# EAGLE design Chessbot_v7 (EAGLE 9.6.2)
AUTHOR: Hudson, Dunn, Ruiz; BOARD_NAME: ChessBotBoard; DOC_NUM: 1; PROJECT_NAME: Chess Bot; REVISION: 7
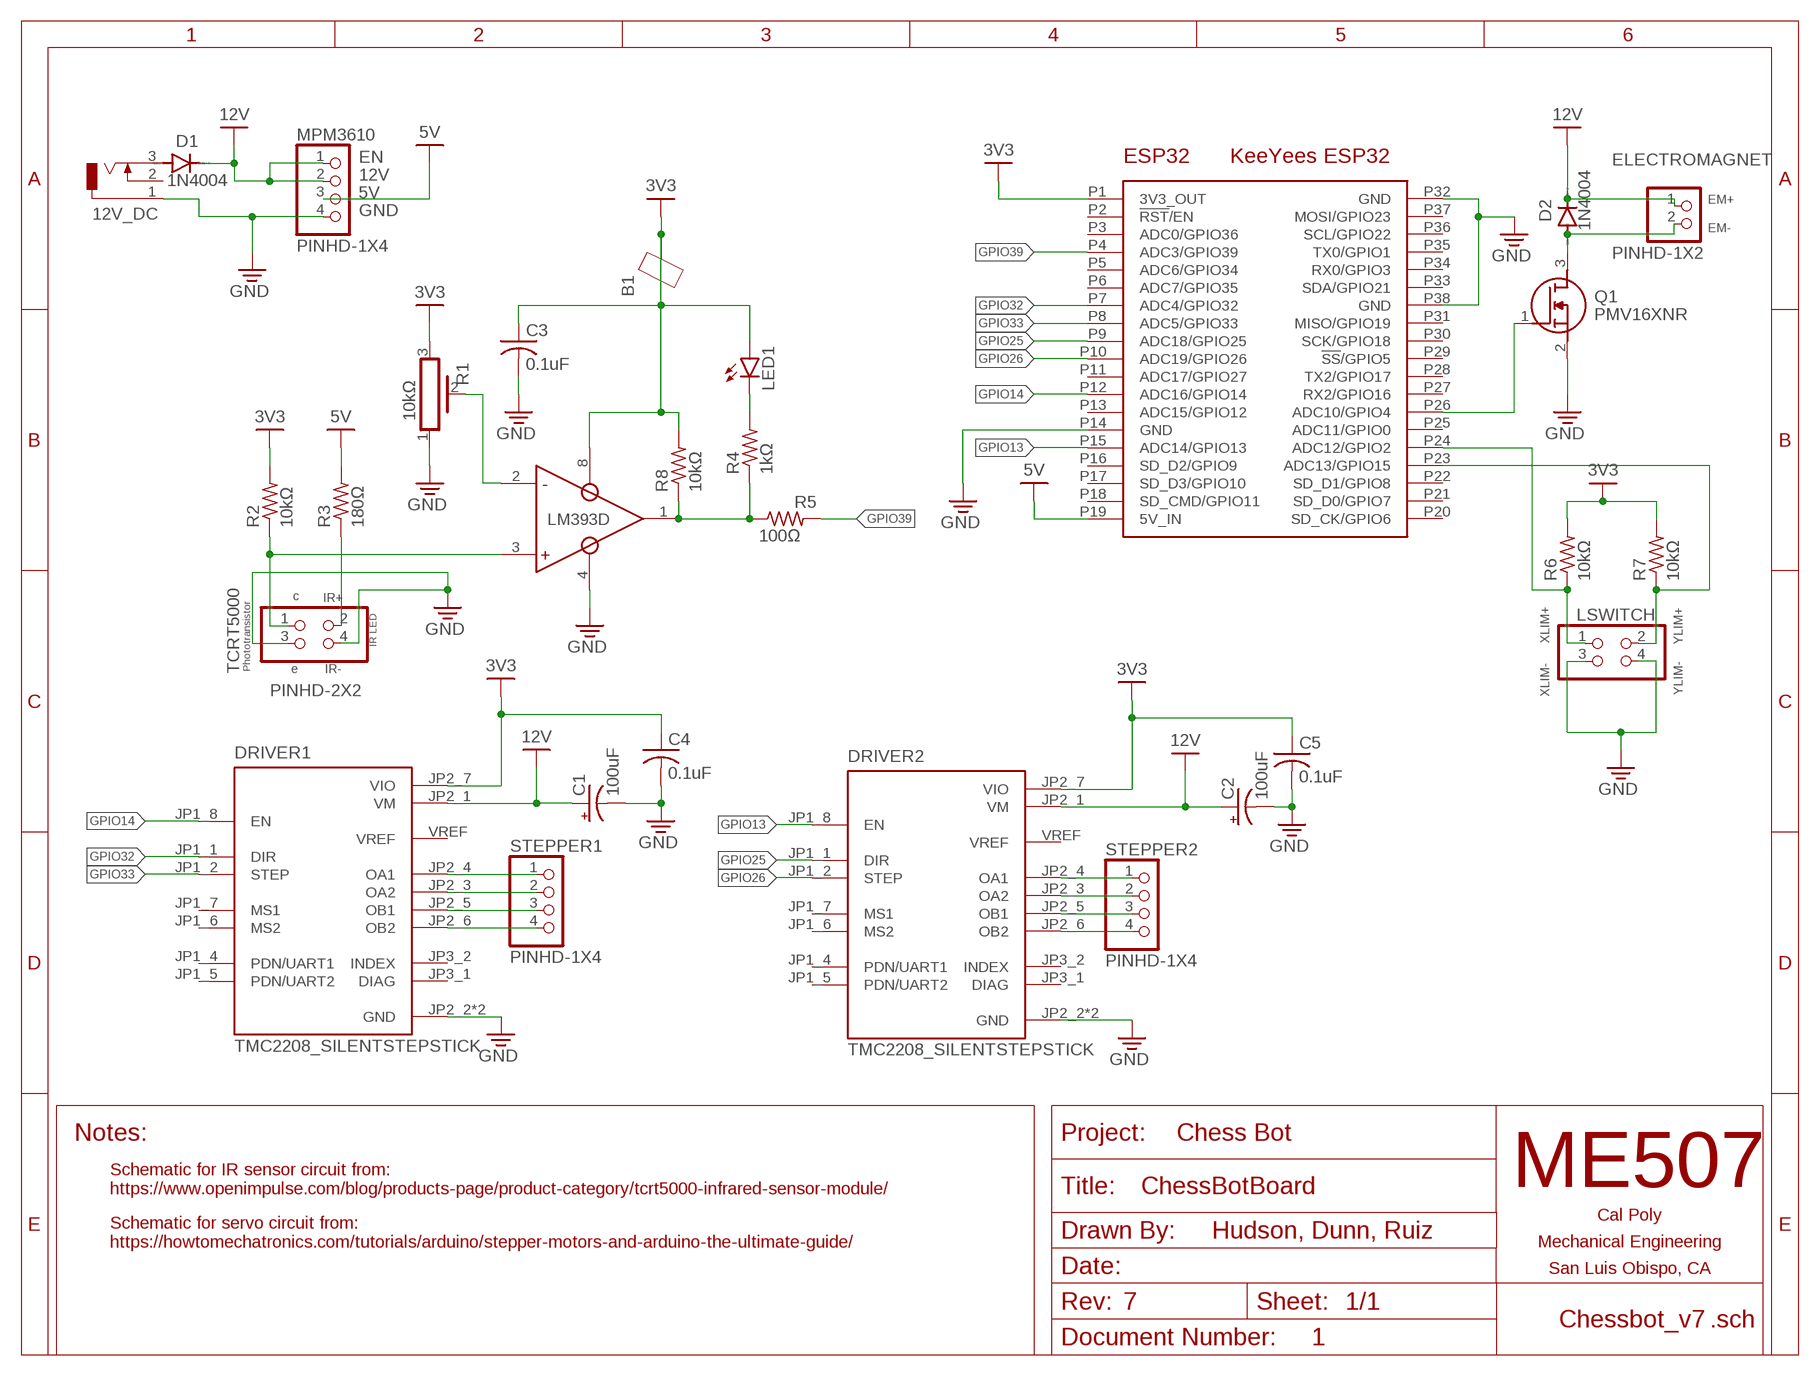
[diagram p0: schematic, sheet 1]

## Parts
12V_DC  DCJ0303  [DCJ0303]
B1  BEAD0805  [0805]
C1  100uF  CPOL-USE2.5-6  [E2,5-6]
C2  100uF  CPOL-USE2.5-6  [E2,5-6]
C3  0.1uF  C-USC0805  [C0805]
C4  0.1uF  C-USC0805  [C0805]
C5  0.1uF  C-USC0805  [C0805]
D1  1N4004  [DO41-10]
D2  1N4004  [DO41-10]
DRIVER1  TMC2208_SILENTSTEPSTICK  [MODULE_TMC2208_SILENTSTEPSTICK]
DRIVER2  TMC2208_SILENTSTEPSTICK  [MODULE_TMC2208_SILENTSTEPSTICK]
ELECTROMAGNET  PINHD-1X2  [1X02]
ESP32  KEEYEES_ESP32  [KEEYEES_ESP32]
LED1  LEDSMT1206  [1206]
LSWITCH  PINHD-2X2  [2X02]
MPM3610  PINHD-1X4  [1X04]
Q1  PMV16XNR  [SOT95P230X110-3N]
R1  10kΩ  PV36Z  [PV36Z]
R2  10kΩ  R-US_R0805  [R0805]
R3  180Ω  R-US_R0805  [R0805]
R4  1kΩ  R-US_R0805  [R0805]
R5  100Ω  R-US_R0805  [R0805]
R6  10kΩ  R-US_R0805  [R0805]
R7  10kΩ  R-US_R0805  [R0805]
R8  10kΩ  R-US_R0805  [R0805]
STEPPER1  PINHD-1X4  [1X04]
STEPPER2  PINHD-1X4  [1X04]
TCRT5000  PINHD-2X2  [2X02]
U$2  LM393D  [LM393D]

## Nets
3V3: B1.1 B1.2 C3.1 C4.1 C5.1 DRIVER1.JP2_7(VIO) DRIVER2.JP2_7(VIO) ESP32.P1(3V3_OUT) LED1.A R1.3 R2.2 R6.2 R7.2 R8.2 U$2.8(VCC)
5V: ESP32.P19(5V_IN) MPM3610.3 R3.2
12V: C1.+ C2.+ D1.C D2.C DRIVER1.JP2_1(VM) DRIVER2.JP2_1(VM) ELECTROMAGNET.1 MPM3610.1 MPM3610.2
GND: 12V_DC.1 C1.- C2.- C3.2 C4.2 C5.2 DRIVER1.JP2_2(GND) DRIVER1.JP2_8(GND) DRIVER2.JP2_2(GND) DRIVER2.JP2_8(GND) ESP32.P14(GND) ESP32.P32(GND) ESP32.P38(GND) LSWITCH.3 LSWITCH.4 MPM3610.4 Q1.2(S) R1.1 TCRT5000.3 TCRT5000.4 U$2.4(GND)
GPIO13: DRIVER2.JP1_8(EN) ESP32.P15(ADC14/GPIO13)
GPIO14: DRIVER1.JP1_8(EN) ESP32.P12(ADC16/GPIO14)
GPIO25: DRIVER2.JP1_1(DIR) ESP32.P9(ADC18/GPIO25)
GPIO26: DRIVER2.JP1_2(STEP) ESP32.P10(ADC19/GPIO26)
GPIO32: DRIVER1.JP1_1(DIR) ESP32.P7(ADC4/GPIO32)
GPIO33: DRIVER1.JP1_2(STEP) ESP32.P8(ADC5/GPIO33)
GPIO39: ESP32.P4(ADC3/GPIO39) R5.2
N$1: R1.2 U$2.2(IN-)
N$2: DRIVER1.JP2_4(OA1) STEPPER1.1
N$3: DRIVER1.JP2_3(OA2) STEPPER1.2
N$4: R3.1 TCRT5000.2
N$5: DRIVER1.JP2_5(OB1) STEPPER1.3
N$6: R2.1 TCRT5000.1 U$2.3(IN+)
N$7: DRIVER1.JP2_6(OB2) STEPPER1.4
N$8: DRIVER2.JP2_4(OA1) STEPPER2.1
N$9: D2.A ELECTROMAGNET.2 Q1.3(D)
N$10: DRIVER2.JP2_3(OA2) STEPPER2.2
N$11: DRIVER2.JP2_5(OB1) STEPPER2.3
N$12: DRIVER2.JP2_6(OB2) STEPPER2.4
N$14: LED1.C R4.2
N$15: 12V_DC.3 D1.A
N$16: R4.1 R5.1 R8.1 U$2.1(OUT)
N$17: ESP32.P26(ADC10/GPIO4) Q1.1(G)
N$18: ESP32.P24(ADC12/GPIO2) LSWITCH.1 R6.1
N$22: ESP32.P23(ADC13/GPIO15) LSWITCH.2 R7.1
Unconnected: 12V_DC.2 DRIVER1.JP1_4(PDN/UART1) DRIVER1.JP1_5(PDN/UART2) DRIVER1.JP1_6(MS2) DRIVER1.JP1_7(MS1) DRIVER1.JP3_1(DIAG) DRIVER1.JP3_2(INDEX) DRIVER1.VREF DRIVER2.JP1_4(PDN/UART1) DRIVER2.JP1_5(PDN/UART2) DRIVER2.JP1_6(MS2) DRIVER2.JP1_7(MS1) DRIVER2.JP3_1(DIAG) DRIVER2.JP3_2(INDEX) DRIVER2.VREF ESP32.P2(!RST!/EN) ESP32.P3(ADC0/GPIO36) ESP32.P5(ADC6/GPIO34) ESP32.P6(ADC7/GPIO35) ESP32.P11(ADC17/GPIO27) ESP32.P13(ADC15/GPIO12) ESP32.P16(SD_D2/GPIO9) ESP32.P17(SD_D3/GPIO10) ESP32.P18(SD_CMD/GPIO11) ESP32.P20(SD_CK/GPIO6) ESP32.P21(SD_D0/GPIO7) ESP32.P22(SD_D1/GPIO8) ESP32.P25(ADC11/GPIO0) ESP32.P27(RX2/GPIO16) ESP32.P28(TX2/GPIO17) ESP32.P29(!SS!/GPIO5) ESP32.P30(SCK/GPIO18) ESP32.P31(MISO/GPIO19) ESP32.P33(SDA/GPIO21) ESP32.P34(RX0/GPIO3) ESP32.P35(TX0/GPIO1) ESP32.P36(SCL/GPIO22) ESP32.P37(MOSI/GPIO23) U$2.5(IN+) U$2.6(IN-) U$2.7(OUT)

## Notes on the sheet
- EN
- 12V
- 5V
- EM+
- GND
- EM-
- c | IR+
- YLIM+
- XLIM+
- IR LED
- Phototransistor | e | IR-
- XLIM- | YLIM-
- Schematic for IR sensor circuit from:
  https://www.openimpulse.com/blog/products-page/product-category/tcrt5000-infrared-sensor-module/
- Schematic for servo circuit from:
  https://howtomechatronics.com/tutorials/arduino/stepper-motors-and-arduino-the-ultimate-guide/

## Library data of the parts
12V_DC = con-jack:DCJ0303: DC POWER JACK Source: DCJ0303.pdf; OC_FARNELL: unknown; OC_NEWARK: unknown
B1 = ME507:BEAD: Ferrite Bead
C1 C2 = rcl:CPOL-US: POLARIZED CAPACITOR, American symbol; SPICEPREFIX: C
C3-C5 = rcl:C-US: CAPACITOR, American symbol; SPICEPREFIX: C
D1 D2 = diode:1N4004: DIODE general purpose rectifier, 1 A
DRIVER1 DRIVER2 = TMC2208_SILENTSTEPSTICK:TMC2208_SILENTSTEPSTICK: TMC2208 Motor Controller/Driver, Stepper Power Management Evaluation Board Check availability <https://pricing.snapeda.com/parts/TMC2208%20SILENTSTEPSTICK/Trinamic%20Motion/view-part?ref=eda>; AVAILABILITY: In Stock; DESCRIPTION: TMC2208 Motor Controller/Driver, Stepper Power Management Evaluation Board; MF: Trinamic Motion; MP: TMC2208 SILENTSTEPSTICK; PACKAGE: None; PRICE: None; PURCHASE-URL: https://pricing.snapeda.com/search/part/TMC2208 SILENTSTEPSTICK/?ref=eda
ELECTROMAGNET = Connector:PINHD-1X2: PIN HEADER; CATEGORY: CONNECTOR; SUB-CATEGORY: PIN-HEADER
ESP32 = ME507:KEEYEES_ESP32: Footprint for an add-on board (shield, hat, etc.) for a KeeYees ESP32 development board with ESP-WROOM-32 module. 38 pins.
LED1 = led:LED: LED OSRAM: - CHIPLED LG R971, LG N971, LY N971, LG Q971, LY Q971, LO R971, LY R971 LH N974, LH R974 LS Q976, LO Q976, LY Q976 LO Q996 - Hyper CHIPLED LW Q18S LB Q993, LB Q99A, LB R99A - SideLED LS A670, LO A670, LY A670, LG A670, LP A670 LB A673, LV A673, LT A673, LW A673 LH A674 LY A675 LS A676, LA A676, LO A676, LY A676, LW A676 LS A679, LY A679, LG A679 - Hyper Micro SIDELED® LS Y876, LA Y876, LO Y876, LY Y876 LT Y87S - SmartLED LW L88C, LW L88S LB L89C, LB L89S, LG L890 LS L89K, LO L89K, LY L89K LS L896, LA L896, LO L896, LY L896 - TOPLED LS T670, LO T670, LY T670, LG T670, LP T670 LSG T670, LSP T670, LSY T670, LOP T670, LYG T670 LG T671, LOG T671, LSG T671 LB T673, LV T673, LT T673, LW T673 LH T674 LS T676, LA T676, LO T676, LY T676, LB T676, LH T676, LSB T676, LW T676 LB T67C, LV T67C, LT T67C, LS T67K, LO T67K, LY T67K, LW E67C LS E67B, LA E67B, LO E67B, LY E67B, LB E67C, LV E67C, LT E67C LW T67C LS T679, LY T679, LG T679 LS T770, LO T770, LY T770, LG T770, LP T770 LB T773, LV T773, LT T773, LW T773 LH T774 LS E675, LA E675, LY E675, LS T675 LS T776, LA T776, LO T776, LY T776, LB T776 LHGB T686 LT T68C, LB T68C - Hyper Mini TOPLED® LB M676 - Mini TOPLED Santana® LG M470 LS M47K, LO M47K, LY M47K Source: http://www.osram.convergy.de LUXEON: - LUMILED® LXK2-PW12-R00, LXK2-PW12-S00, LXK2-PW14-U00, LXK2-PW14-V00 LXK2-PM12-R00, LXK2-PM12-S00, LXK2-PM14-U00 LXK2-PE12-Q00, LXK2-PE12-R00, LXK2-PE12-S00, LXK2-PE14-T00, LXK2-PE14-U00 LXK2-PB12-K00, LXK2-PB12-L00, LXK2-PB12-M00, LXK2-PB14-N00, LXK2-PB14-P00, LXK2-PB14-Q00 LXK2-PR12-L00, LXK2-PR12-M00, LXK2-PR14-Q00, LXK2-PR14-R00 LXK2-PD12-Q00, LXK2-PD12-R00, LXK2-PD12-S00 LXK2-PH12-R00, LXK2-PH12-S00 LXK2-PL12-P00, LXK2-PL12-Q00, LXK2-PL12-R00 Source: www.luxeon.com KINGBRIGHT: KA-3528ASYC Source: www.kingbright.com
LSWITCH = pinhead:PINHD-2X2: PIN HEADER
MPM3610 STEPPER1 STEPPER2 = Connector:PINHD-1X4: PIN HEADER; CATEGORY: CONNECTOR; SUB-CATEGORY: PIN-HEADER
Q1 = PMV16XNR:PMV16XNR: Nexperia PMV16XNR N-channel MOSFET, 8.6 A, 20 V PMV16XN, 3-Pin SOT-23 Source: Datasheet <https://assets.nexperia.com/documents/data-sheet/PMV16XN.pdf>; DESCRIPTION: Nexperia PMV16XNR N-channel MOSFET, 8.6 A, 20 V PMV16XN, 3-Pin SOT-23; HEIGHT: 1.1mm; MANUFACTURER_NAME: Nexperia; MANUFACTURER_PART_NUMBER: PMV16XNR; MOUSER_PART_NUMBER: 771-PMV16XNR; MOUSER_PRICE-STOCK: https://www.mouser.co.uk/ProductDetail/Nexperia/PMV16XNR?qs=%252BRKXB2WKlSfp5fVW5DDV6w%3D%3D
R1 = Resistor:PV36: Rectangular Trimmer Potentiometers - PV36 Series Datasheet <https://www.bourns.com/docs/Product-Datasheets/pv36.pdf>; CATEGORY: Resistor; DESCRIPTION: Lead Sealed Type Multiturn PV36 Series; MANUFACTURER: BOURNS; MPN: PV36Z; OPERATING_TEMPERATURE: -55 to +125 °C; PART_STATUS: Active; ROHS_COMPLIANCE: RoHS Compliant; SERIES: PV36; SUB-CATEGORY: Trimpot; TYPE: Lead Sealed
R2-R8 = rcl:R-US_: RESISTOR, American symbol; SPICEPREFIX: R
TCRT5000 = Connector:PINHD-2X2: PIN HEADER; CATEGORY: CONNECTOR; SUB-CATEGORY: PIN-HEADER
U$2 = lm393d:LM393D

## Board
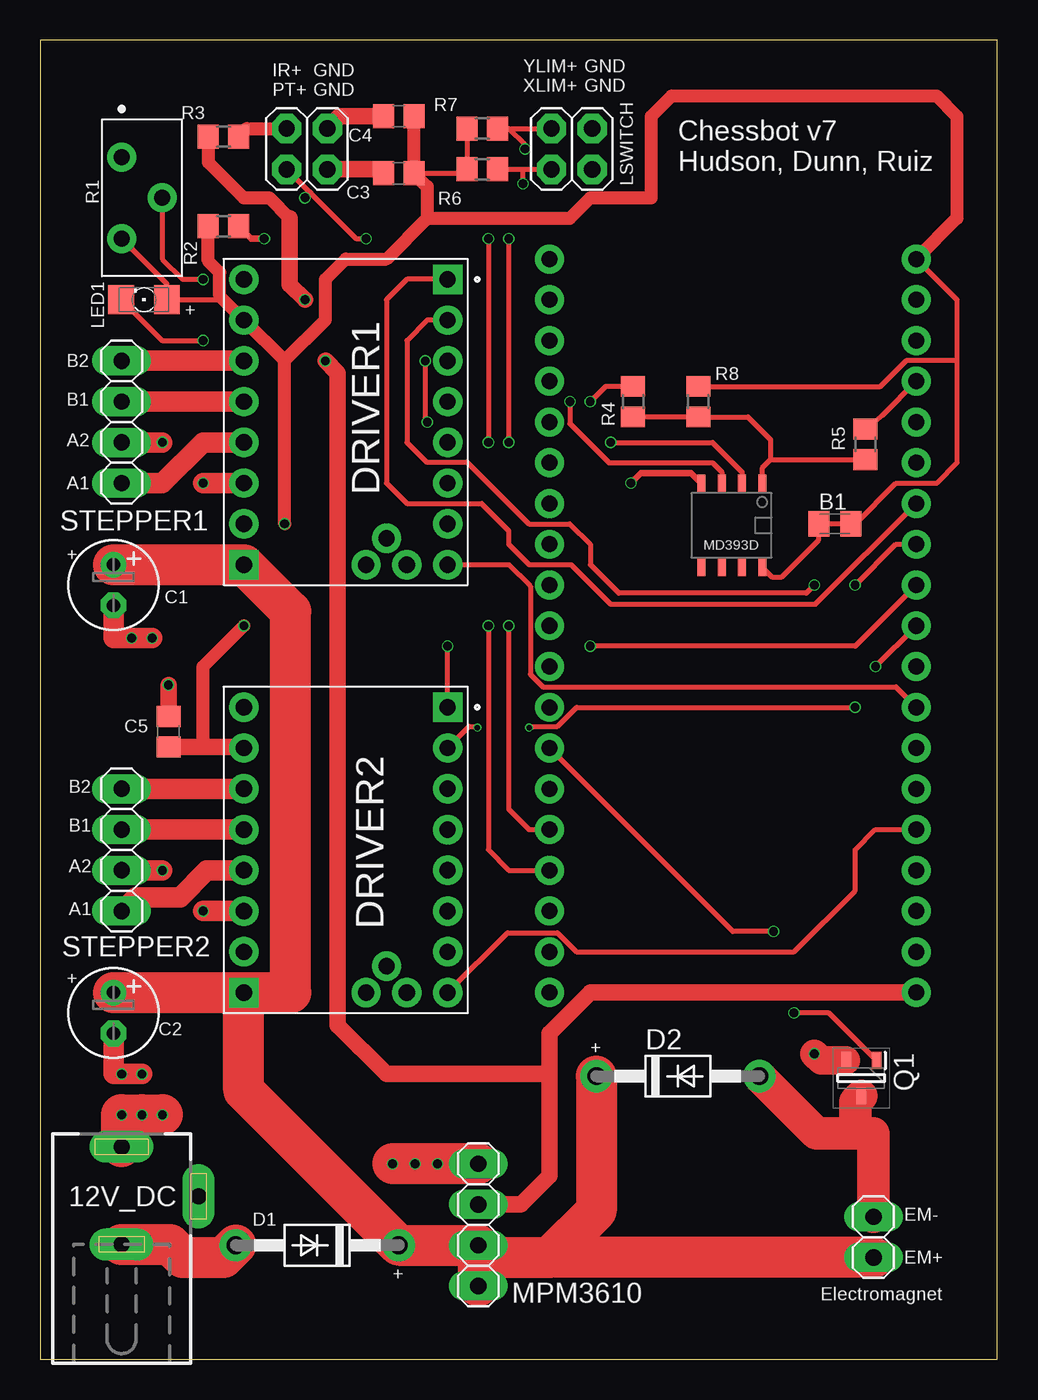
[diagram p1: board, top side]
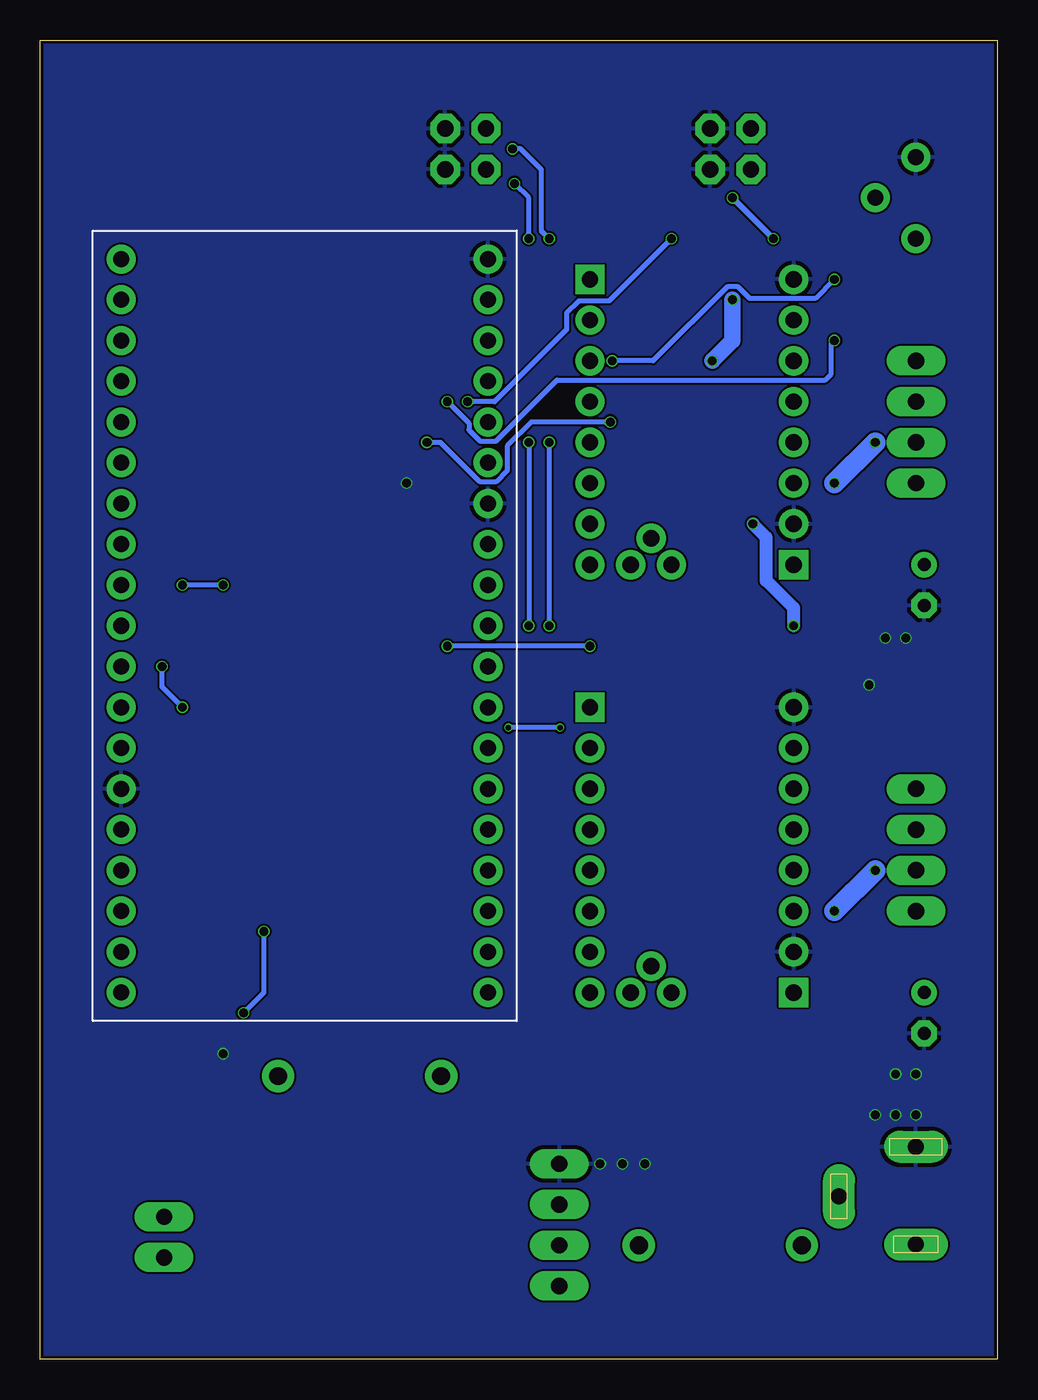
[diagram p2: board, bottom side, seen from below]

Size 59.67 x 82.22 mm. Coordinates in mm from the lower left corner, seen from the top.
Outline: 0,0 59.67,0 59.67,82.22 0,82.22 0,0
Copper layers (1*16): Top 0.035mm / dielectric 1.6mm / Bottom 0.035mm
Design rules "jlcpcb-2layers": minimum track width 5mil, minimum drill 0.3mm, track to track 5mil, track to pad 5mil, pad to pad 5mil, via to via 5mil, smd to smd 5mil, copper to edge 0.2mm, drill to drill 6mil, minimum pad ring 10mil, minimum via ring 3mil, stop-mask expansion 4mil, vias tented up to drill 0mil, thermal gap 10mil

### Footprints (pad centres in the part's own frame; a part is rotated, then mirrored left to right if it is on the bottom)
DCJ0303 = drill 1 pad 2 long: 1 0,3.1; 2 4.8,0; 3 0,-3
0805 = smd 1.3 x 1.6: 1 -1,0; 2 1,0
E2,5-6 = drill 0.813 pad 1.6: + -1.27,0 | drill 0.813 pad 1.6 octagon: - 1.27,0
C0805 = smd 1.3 x 1.5: 1 -0.95,0; 2 0.95,0
DO41-10 = drill 1.118: A 5.08,0; C -5.08,0
MODULE_TMC2208_SILENTSTEPSTICK = drill 1.016 square: JP1_1 6.35,8.89; JP2_1 -6.35,-8.89 | drill 1.016: JP1_2 6.35,6.35; JP1_3 6.35,3.81; JP1_4 6.35,1.27; JP1_5 6.35,-1.27; JP1_6 6.35,-3.81; JP1_7 6.35,-6.35; JP1_8 6.35,-8.89; JP2_2 -6.35,-6.35; JP2_3 -6.35,-3.81; JP2_4 -6.35,-1.27; JP2_5 -6.35,1.27; JP2_6 -6.35,3.81; JP2_7 -6.35,6.35; JP2_8 -6.35,8.89; JP3_1 1.27,-8.89; JP3_2 3.81,-8.89; VREF 2.54,-7.239
1X02 = drill 1.016 long: 1 -1.27,0; 2 1.27,0
KEEYEES_ESP32 = drill 1 pad 1.778: P1 -11.43,21.59; P2 -11.43,19.05; P3 -11.43,16.51; P4 -11.43,13.97; P5 -11.43,11.43; P6 -11.43,8.89; P7 -11.43,6.35; P8 -11.43,3.81; P9 -11.43,1.27; P10 -11.43,-1.27; P11 -11.43,-3.81; P12 -11.43,-6.35; P13 -11.43,-8.89; P14 -11.43,-11.43; P15 -11.43,-13.97; P16 -11.43,-16.51; P17 -11.43,-19.05; P18 -11.43,-21.59; P19 -11.43,-24.13; P20 11.43,-24.13; P21 11.43,-21.59; P22 11.43,-19.05; P23 11.43,-16.51; P24 11.43,-13.97; P25 11.43,-11.43; P26 11.43,-8.89; P27 11.43,-6.35; P28 11.43,-3.81; P29 11.43,-1.27; P30 11.43,1.27; P31 11.43,3.81; P32 11.43,6.35; P33 11.43,8.89; P34 11.43,11.43; P35 11.43,13.97; P36 11.43,16.51; P37 11.43,19.05; P38 11.43,21.59
1206 = smd 1.6 x 1.803: A -1.422,0; C 1.422,0
2X02 = drill 1.016 octagon: 1 -1.27,-1.27; 2 -1.27,1.27; 3 1.27,-1.27; 4 1.27,1.27
1X04 = drill 1.016 long: 1 -3.81,0; 2 -1.27,0; 3 1.27,0; 4 3.81,0
SOT95P230X110-3N = smd 1.05 x 0.6: 1 -1.1,0.95; 2 -1.1,-0.95; 3 1.1,0
PV36Z = drill 1 pad 1.564: 1 0,0; 2 2.54,2.54; 3 5.08,0
R0805 = smd 1.3 x 1.5: 1 -0.95,0; 2 0.95,0
LM393D = smd 0.5 x 1.1: 1 0.57,-0.62; 2 1.84,-0.62; 3 3.11,-0.62; 4 4.38,-0.62; 5 4.38,4.62; 6 3.11,4.62; 7 1.84,4.62; 8 0.57,4.62

### Placement (x,y rotation side)
12V_DC  5.08,10.16 0 top
B1  49.53,52.07 0 top
C1  4.57,48.26 270 top
C2  4.57,21.59 270 top
C3  22.35,73.91 180 top
C4  22.35,77.47 180 top
C5  8,39.12 90 top
D1  17.27,7.11 180 top
D2  39.75,17.65 0 top
DRIVER1  19.05,58.42 0 top
DRIVER2  19.05,31.75 0 top
ELECTROMAGNET  51.94,7.62 90 top
ESP32  43.18,46.99 0 bottom
LED1  6.48,66.04 180 top
LSWITCH  33.15,75.44 0 top
MPM3610  27.3,8.38 90 top
Q1  51.18,17.53 270 top
R1  5.08,74.93 270 top
R2  11.43,70.61 180 top
R3  11.43,76.2 180 top
R4  36.96,59.69 90 top
R5  51.44,57.02 90 top
R6  27.56,74.17 180 top
R7  27.56,76.71 180 top
R8  41.02,59.69 90 top
STEPPER1  5.08,58.42 90 top
STEPPER2  5.08,31.75 90 top
TCRT5000  16.64,75.44 0 top
U$2  45.59,53.98 180 top

### Tracks (layer width: path | path; a pad name or v marks a point on that pad's centre or on a via)
3V3  (via drill 0.55)
  Top 0.305: ESP32.P1 57.15,66.04 57.15,62.23 | 57.15,62.23 57.15,55.88 55.88,54.61 53.34,54.61 50.8,52.07 B1.2 B1.1 48.53,51.07 46.23,48.77 45.61,48.77 U$2.8 | 57.15,62.23 53.98,62.23 52.38,60.64 R8.2 | R1.3 7.9,67.03 LED1.A 10.96,66.04 11.2,66.27 | R7.2 R6.2 | C3.1 26.36,73.91
  Top 0.813: 10.16,38.17 10.16,43.18 v12.7,45.72 | v15.24,52.07 15.24,62.23 | 15.24,62.23 DRIVER1.JP2_7 11.2,66.27 11.2,67.74 10.48,68.46 R2.2 | 15.24,62.23 17.78,64.77 17.78,67.31 19.05,68.58 21.59,68.58 24.13,71.12 | 26.36,73.91 R6.2 | 24.13,71.12 33.02,71.12 34.29,72.39 38.1,72.39 38.1,77.47 39.37,78.74 55.88,78.74 57.15,77.47 57.15,71.12 ESP32.P1 | 24.13,71.12 24.13,73.09 C3.1 C4.1
  Top 1.016: C5.1 10.16,38.17 12.63,38.17 DRIVER2.JP2_7
  Bottom 0.813: v12.7,45.72 12.7,46.84 14.4,48.54 14.4,51.23 v15.24,52.07
5V  (via drill 0.55)
  Top 0.813: R3.2 10.48,74.61 12.7,72.39 14.29,72.39 15.56,71.12
  Top 1.016: ESP32.P19 34.29,22.86 31.75,20.32 31.75,17.78 | MPM3610.3 29.97,9.65 31.75,11.43 31.75,17.78 | 31.75,17.78 21.59,17.78 18.54,20.83 18.54,61.47 v17.78,62.23 | v16.51,66.04 15.56,66.99 15.56,71.12
  Bottom 1.016: v17.78,62.23 16.51,63.5 v16.51,66.04
12V
  Top 2.54: DRIVER2.JP2_1 12.7,16.76 D1.C MPM3610.2 | C2.+ DRIVER2.JP2_1 | DRIVER2.JP2_1 15.62,22.86 15.62,46.61 DRIVER1.JP2_1 C1.+ | ELECTROMAGNET.1 31.75,6.35 | MPM3610.2 MPM3610.1 | MPM3610.2 28.07,6.35 31.75,6.35 | D2.C 34.67,9.27 31.75,6.35
GND  (via drill 0.55)
  Top 0.406: v36.83,54.61 37.45,55.23 40.58,55.23 U$2.4
  Top 1.016: C5.2 v8,42.04 | TCRT5000.4 18.67,77.47 C4.2 | TCRT5000.3 21.15,74.17 C3.2
  Top 1.27: C2.- 4.57,17.78 v5.08,17.78 v6.35,17.78 | C1.- 4.57,44.96 v5.71,44.96 v6.99,44.96
  Top 1.778: v48.26,19.05 48.68,18.63 Q1.2
  Top 2.54: MPM3610.4 v24.77,12.19 v23.37,12.19 v21.97,12.19 | 12V_DC.1 v5.08,15.24 v6.35,15.24 v7.62,15.24
  pour Bottom: 0,82.55 0,0 59.69,0 59.69,82.55
GPIO13
  Top 0.305: DRIVER2.JP1_8 29.13,26.59 32.24,26.59 33.44,25.4 46.99,25.4 50.8,29.21 50.8,31.75 52.07,33.02 ESP32.P15
GPIO14
  Top 0.305: ESP32.P12 53.34,41.91 31.33,41.91 30.56,42.69 30.56,48.18 29.21,49.53 DRIVER1.JP1_8
GPIO25  (via drill 0.55)
  Top 0.305: DRIVER2.JP1_1 v25.4,44.45 | v34.29,44.45 50.8,44.45 ESP32.P9
  Bottom 0.305: v25.4,44.45 v34.29,44.45
GPIO26  (via drill 0.35, 0.55)
  Top 0.305: v50.8,40.64 33.44,40.64 32.24,39.45 30.56,39.45 v30.48,39.37 | DRIVER2.JP1_2 26.75,39.45 27.18,39.45 v27.26,39.37 | v52.07,43.18 ESP32.P10
  Bottom 0.305: v50.8,40.64 52.07,41.91 v52.07,43.18 | v27.26,39.37 v30.48,39.37
GPIO32
  Top 0.305: DRIVER1.JP1_1 22.86,67.31 21.59,66.04 21.59,54.61 22.86,53.34 27.52,53.34 29.21,51.65 29.21,50.8 30.48,49.53 33.1,49.53 35.56,47.07 48.34,47.07 ESP32.P7
GPIO33  (via drill 0.55)
  Top 0.305: DRIVER1.JP1_2 24.13,64.77 22.86,63.5 22.86,57.15 24.08,55.93 26.62,55.93 30.48,52.07 33.02,52.07 34.29,50.8 34.29,49.53 36.07,47.75 47.75,47.75 v48.26,48.26 | v50.8,48.26 53.34,50.8 ESP32.P8
  Bottom 0.305: v48.26,48.26 v50.8,48.26
GPIO39
  Top 0.305: ESP32.P4 52.48,58.83 R5.2
N$1  (via drill 0.55)
  Top 0.305: R1.2 7.62,68.58 8.89,67.31 v10.16,67.31 | v24.01,62.23 24.01,58.54 v24.13,58.42 | v35.56,57.15 41.91,57.15 43.75,55.31 U$2.2
  Bottom 0.305: v24.01,62.23 21.47,62.23 16.85,66.85 16.17,66.85 15.44,66.12 11.35,66.12 v10.16,67.31 | v24.13,58.42 29.05,58.42 30.56,56.91 30.56,55.39 31.26,54.69 32.24,54.69 34.71,57.15 v35.56,57.15
N$2
  Top 1.27: STEPPER1.1 7.62,54.61 10.16,57.15 DRIVER1.JP2_4
N$3  (via drill 0.55)
  Top 1.27: STEPPER1.2 v7.62,57.15 | v10.16,54.61 DRIVER1.JP2_3
  Bottom 1.27: v7.62,57.15 v10.16,54.61
N$4
  Top 0.813: R3.1 12.89,76.71 TCRT5000.2
N$5
  Top 1.27: STEPPER1.3 DRIVER1.JP2_5
N$6  (via drill 0.55)
  Top 0.305: TCRT5000.1 16.83,72.71 19.68,69.85 v20.32,69.85 | v33.02,59.69 33.02,58.31 35.45,55.88 41.91,55.88 42.48,55.31 U$2.3
  Top 0.406: R2.1 13.14,69.85 v13.97,69.85 | v16.51,72.39 16.83,72.71
  Bottom 0.305: v20.32,69.85 24.21,65.96 26.1,65.96 26.85,65.21 26.85,64.17 31.33,59.69 v33.02,59.69
  Bottom 0.406: v13.97,69.85 v16.51,72.39
N$7
  Top 1.27: STEPPER1.4 DRIVER1.JP2_6
N$8
  Top 1.27: STEPPER2.1 5.94,28.8 8.72,28.8 10.39,30.48 DRIVER2.JP2_4
N$9
  Top 2.032: ELECTROMAGNET.2 51.94,14.1 50.8,14.1 | D2.A 48.39,14.1 50.8,14.1 | 50.8,14.1 50.8,16.05 Q1.3
N$10  (via drill 0.55)
  Top 1.27: STEPPER2.2 v7.62,30.48 | v10.16,27.94 DRIVER2.JP2_3
  Bottom 1.27: v7.62,30.48 v10.16,27.94
N$11
  Top 1.27: STEPPER2.3 DRIVER2.JP2_5
N$12
  Top 1.27: STEPPER2.4 DRIVER2.JP2_6
N$14  (via drill 0.55)
  Top 0.305: R4.2 35.24,60.64 v34.29,59.69 | LED1.C 7.59,63.5 v10.16,63.5
  Bottom 0.305: v10.16,63.5 10.36,63.3 10.36,61.41 10.73,61.04 27.45,61.04 31.26,57.23 32.24,57.23 32.94,57.93 32.94,58.34 v34.29,59.69
N$15
  Top 2.54: 12V_DC.3 8.08,7.16 8.89,6.35 11.43,6.35 D1.A
N$16
  Top 0.305: U$2.1 45.02,55.56 45.53,56.07 | R4.1 R8.1 44.13,58.74 45.53,57.34 45.53,56.07 | 45.53,56.07 R5.1
N$17  (via drill 0.55)
  Top 0.305: Q1.1 49.17,21.59 v46.99,21.59 | v45.72,26.67 43.18,26.67 ESP32.P26
  Bottom 0.305: v46.99,21.59 45.72,22.86 v45.72,26.67
N$18  (via drill 0.55)
  Top 0.305: v29.21,69.85 v29.21,57.15 | ESP32.P24 30.48,33.02 29.21,34.29 v29.21,45.72 | R6.1 30.1,74.17 | 30.1,74.17 LSWITCH.1 | v30.1,73.28 30.1,74.17
  Bottom 0.305: v29.21,69.85 29.21,72.39 v30.1,73.28 | v29.21,57.15 v29.21,45.72
N$22  (via drill 0.55)
  Top 0.305: v27.94,69.85 v27.94,57.15 | ESP32.P23 29.21,30.48 27.94,31.75 v27.94,45.72 | R7.1 29.21,76.71 | 29.21,76.71 LSWITCH.2 | v30.23,75.44 30.23,75.69 29.21,76.71
  Bottom 0.305: v27.94,57.15 v27.94,45.72 | v30.23,75.44 29.72,75.44 28.45,74.17 28.45,70.36 v27.94,69.85

### Text on the board
tNames: IR+ / PT+ | GND / GND | YLIM+ / XLIM+ | GND / GND | Chessbot v7 / Hudson, Dunn, Ruiz | + | B2 | B1 | A2 | A1 | + | B2 | B1 | A2 | A1 | + | + | EM- | EM+ | + | Electromagnet